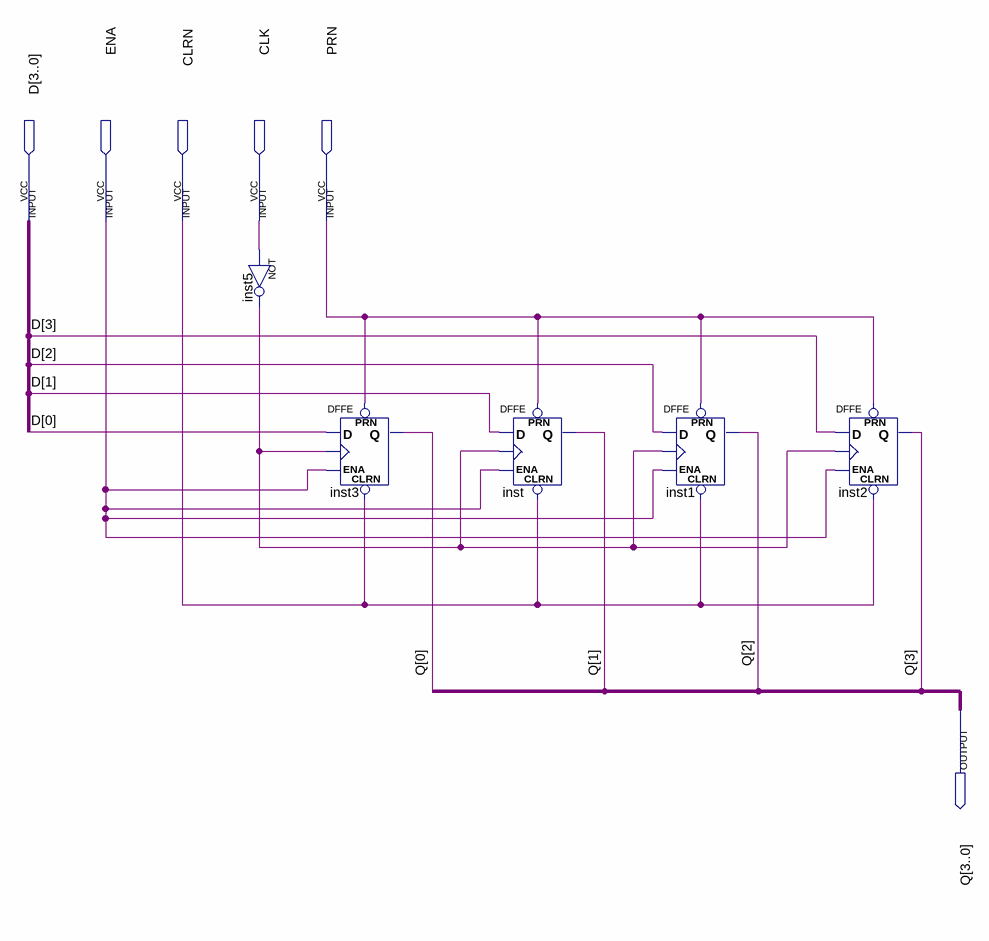
[diagram p0: schematic sheet]
// Quartus schematic dffe4.bdf as structural Verilog: 5 symbols, 6 pins
module dffe4 (
  input  [3:0] D,
  input  ENA,
  input  CLRN,
  input  CLK,
  input  PRN,
  output [3:0] Q
);

  wire inst5_out;

  not inst5 (inst5_out, CLK);
  DFFE inst3 (.PRN(PRN), .CLRN(CLRN), .D(D[0]), .CLK(inst5_out), .ENA(ENA), .Q(Q[0]));
  DFFE inst (.PRN(PRN), .CLRN(CLRN), .D(D[1]), .CLK(inst5_out), .ENA(ENA), .Q(Q[1]));
  DFFE inst1 (.PRN(PRN), .CLRN(CLRN), .D(D[2]), .CLK(inst5_out), .ENA(ENA), .Q(Q[2]));
  DFFE inst2 (.PRN(PRN), .CLRN(CLRN), .D(D[3]), .CLK(inst5_out), .ENA(ENA), .Q(Q[3]));
endmodule
